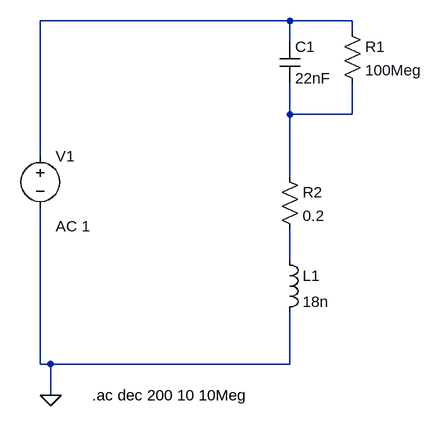
[diagram p0: schematic modelo_cap.asc]
modelo_cap.asc, the LTspice schematic file:
Version 4
SHEET 1 880 680
WIRE 176 16 -208 16
WIRE 272 16 176 16
WIRE 272 32 272 16
WIRE 176 48 176 16
WIRE 176 160 176 112
WIRE 272 160 272 112
WIRE 272 160 176 160
WIRE -208 224 -208 16
WIRE 176 256 176 160
WIRE 176 384 176 336
WIRE -208 544 -208 304
WIRE -192 544 -208 544
WIRE 176 544 176 464
WIRE 176 544 -192 544
WIRE -192 592 -192 544
FLAG -192 592 0
SYMBOL res 160 240 R0
SYMATTR InstName R2
SYMATTR Value 0.2
SYMBOL ind 160 368 R0
SYMATTR InstName L1
SYMATTR Value 18n
SYMBOL cap 160 48 R0
SYMATTR InstName C1
SYMATTR Value 22nF
SYMBOL voltage -208 208 R0
WINDOW 123 24 124 Left 2
WINDOW 39 0 0 Left 0
SYMATTR InstName V1
SYMATTR Value ""
SYMATTR Value2 AC 1
SYMBOL res 256 16 R0
SYMATTR InstName R1
SYMATTR Value 100Meg
TEXT -128 592 Left 2 !.ac dec 200 10 10Meg

The netlist it stands for:
* modelo_cap.asc
R2 N002 N003 0.2
L1 N003 0 18n
C1 N001 N002 22nF
V1 N001 0 AC 1
R1 N001 N002 100Meg
.ac dec 200 10 10Meg
.backanno
.end